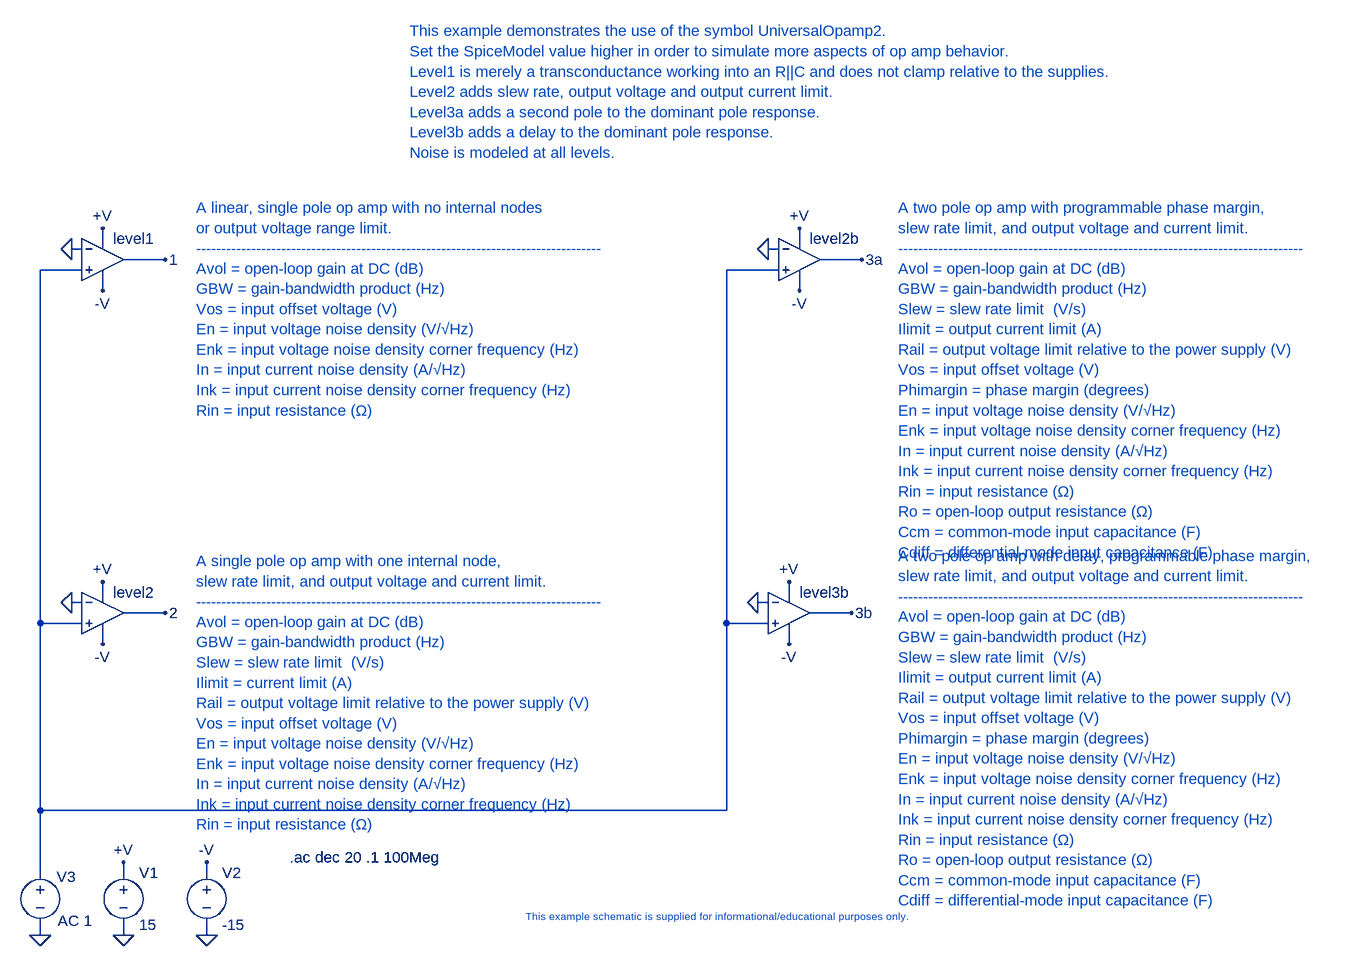
[diagram p0: schematic UniversalOpamp2.asc]
UniversalOpamp2.asc, the LTspice schematic file:
Version 4
SHEET 1 2580 1112
WIRE 144 -224 144 -240
WIRE 1216 -224 1216 -240
WIRE 112 -208 96 -208
WIRE 1184 -208 1168 -208
WIRE 240 -192 176 -192
WIRE 1312 -192 1248 -192
WIRE 112 -176 48 -176
WIRE 1184 -176 1104 -176
WIRE 144 -144 144 -160
WIRE 1216 -144 1216 -160
WIRE 144 320 144 304
WIRE 1200 320 1200 304
WIRE 112 336 96 336
WIRE 1168 336 1152 336
WIRE 240 352 176 352
WIRE 1296 352 1232 352
WIRE 48 368 48 -176
WIRE 112 368 48 368
WIRE 1104 368 1104 -176
WIRE 1168 368 1104 368
WIRE 144 400 144 384
WIRE 1200 400 1200 384
WIRE 48 656 48 368
WIRE 1104 656 1104 368
WIRE 1104 656 48 656
WIRE 48 752 48 656
WIRE 176 752 176 736
WIRE 304 752 304 736
WIRE 48 848 48 832
WIRE 176 848 176 832
WIRE 304 848 304 832
FLAG 144 -240 +V
FLAG 144 -144 -V
FLAG 96 -208 0
FLAG 304 848 0
FLAG 176 848 0
FLAG 176 736 +V
FLAG 304 736 -V
FLAG 48 848 0
FLAG 144 304 +V
FLAG 144 400 -V
FLAG 96 336 0
FLAG 1200 304 +V
FLAG 1200 400 -V
FLAG 1152 336 0
FLAG 1216 -240 +V
FLAG 1216 -144 -V
FLAG 1168 -208 0
FLAG 240 -192 1
FLAG 240 352 2
FLAG 1296 352 3b
FLAG 1312 -192 3a
SYMBOL voltage 176 736 R0
SYMATTR InstName V1
SYMATTR Value 15
SYMBOL voltage 304 736 R0
SYMATTR InstName V2
SYMATTR Value -15
SYMBOL voltage 48 736 R0
WINDOW 0 25 22 Left 2
WINDOW 3 27 90 Left 2
SYMATTR InstName V3
SYMATTR Value AC 1
SYMBOL OpAmps\\UniversalOpamp2 144 -192 R0
SYMATTR InstName level1
SYMATTR SpiceModel level1
SYMBOL OpAmps\\UniversalOpamp2 144 352 R0
SYMATTR InstName level2
SYMATTR SpiceModel level2
SYMBOL OpAmps\\UniversalOpamp2 1216 -192 R0
SYMATTR InstName level2b
SYMBOL OpAmps\\UniversalOpamp2 1200 352 R0
SYMATTR InstName level3b
SYMATTR SpiceModel level3b
TEXT 432 728 Left 2 !.ac dec 20 .1 100Meg
TEXT 288 -272 Left 2 ;A linear, single pole op amp with no internal nodes\nor output voltage range limit.\n---------------------------------------------------------------------------------\nAvol = open-loop gain at DC (dB)\nGBW = gain-bandwidth product (Hz)\nVos = input offset voltage (V)\nEn = input voltage noise density (V/√Hz)\nEnk = input voltage noise density corner frequency (Hz)\nIn = input current noise density (A/√Hz)\nInk = input current noise density corner frequency (Hz)\nRin = input resistance (Ω)
TEXT 288 272 Left 2 ;A single pole op amp with one internal node,\nslew rate limit, and output voltage and current limit.\n---------------------------------------------------------------------------------\nAvol = open-loop gain at DC (dB)\nGBW = gain-bandwidth product (Hz)\nSlew = slew rate limit  (V/s) \nIlimit = current limit (A)\nRail = output voltage limit relative to the power supply (V)\nVos = input offset voltage (V)\nEn = input voltage noise density (V/√Hz)\nEnk = input voltage noise density corner frequency (Hz)\nIn = input current noise density (A/√Hz)\nInk = input current noise density corner frequency (Hz)\nRin = input resistance (Ω)
TEXT 1368 264 Left 2 ;A two pole op amp with delay, programmable phase margin,\nslew rate limit, and output voltage and current limit.\n---------------------------------------------------------------------------------\nAvol = open-loop gain at DC (dB)\nGBW = gain-bandwidth product (Hz)\nSlew = slew rate limit  (V/s) \nIlimit = output current limit (A)\nRail = output voltage limit relative to the power supply (V)\nVos = input offset voltage (V)\nPhimargin = phase margin (degrees)\nEn = input voltage noise density (V/√Hz)\nEnk = input voltage noise density corner frequency (Hz)\nIn = input current noise density (A/√Hz)\nInk = input current noise density corner frequency (Hz)\nRin = input resistance (Ω)\nRo = open-loop output resistance (Ω)\nCcm = common-mode input capacitance (F)\nCdiff = differential-mode input capacitance (F)
TEXT 1368 -272 Left 2 ;A two pole op amp with programmable phase margin,\nslew rate limit, and output voltage and current limit.\n---------------------------------------------------------------------------------\nAvol = open-loop gain at DC (dB)\nGBW = gain-bandwidth product (Hz)\nSlew = slew rate limit  (V/s) \nIlimit = output current limit (A)\nRail = output voltage limit relative to the power supply (V)\nVos = input offset voltage (V)\nPhimargin = phase margin (degrees)\nEn = input voltage noise density (V/√Hz)\nEnk = input voltage noise density corner frequency (Hz)\nIn = input current noise density (A/√Hz)\nInk = input current noise density corner frequency (Hz)\nRin = input resistance (Ω)\nRo = open-loop output resistance (Ω)\nCcm = common-mode input capacitance (F)\nCdiff = differential-mode input capacitance (F)
TEXT 1080 808 Top 1 ;This example schematic is supplied for informational/educational purposes only.
TEXT 616 -544 Left 2 ;This example demonstrates the use of the symbol UniversalOpamp2.\nSet the SpiceModel value higher in order to simulate more aspects of op amp behavior.  \nLevel1 is merely a transconductance working into an R||C and does not clamp relative to the supplies.\nLevel2 adds slew rate, output voltage and output current limit.  \nLevel3a adds a second pole to the dominant pole response.\nLevel3b adds a delay to the dominant pole response.  \nNoise is modeled at all levels.

The netlist it stands for:
* UniversalOpamp2.asc
V1 +V 0 15
V2 -V 0 -15
V3 N001 0 AC 1
Xlevel1 N001 0 +V -V 1 level1 Avol=1Meg GBW=10Meg Slew=10Meg Ilimit=25m Rail=0 Vos=0 En=0 Enk=0 In=0 Ink=0 Rin=500Meg  ; pins In+ In- V+ V- OUT
Xlevel2 N001 0 +V -V 2 level2 Avol=1Meg GBW=10Meg Slew=10Meg Ilimit=25m Rail=0 Vos=0 En=0 Enk=0 In=0 Ink=0 Rin=500Meg  ; pins In+ In- V+ V- OUT
Xlevel2b N001 0 +V -V 3a level.2 Avol=1Meg GBW=10Meg Slew=10Meg ilimit=25m rail=0 Vos=0 phimargin=45 en=0 enk=0 in=0 ink=0 Rin=500Meg  ; pins IN+ IN- V+ V- OUT
Xlevel3b N001 0 +V -V 3b level3b Avol=1Meg GBW=10Meg Slew=10Meg Ilimit=25m Rail=0 Vos=0 En=0 Enk=0 In=0 Ink=0 Rin=500Meg  ; pins In+ In- V+ V- OUT
.ac dec 20 .1 100Meg
* A linear, single pole op amp with no internal nodes
* or output voltage range limit.
* ---------------------------------------------------------------------------------
* Avol = open-loop gain at DC (dB)
* GBW = gain-bandwidth product (Hz)
* Vos = input offset voltage (V)
* En = input voltage noise density (V/√Hz)
* Enk = input voltage noise density corner frequency (Hz)
* In = input current noise density (A/√Hz)
* Ink = input current noise density corner frequency (Hz)
* Rin = input resistance (Ω)
* A single pole op amp with one internal node,
* slew rate limit, and output voltage and current limit.
* ---------------------------------------------------------------------------------
* Avol = open-loop gain at DC (dB)
* GBW = gain-bandwidth product (Hz)
* Slew = slew rate limit  (V/s)
* Ilimit = current limit (A)
* Rail = output voltage limit relative to the power supply (V)
* Vos = input offset voltage (V)
* En = input voltage noise density (V/√Hz)
* Enk = input voltage noise density corner frequency (Hz)
* In = input current noise density (A/√Hz)
* Ink = input current noise density corner frequency (Hz)
* Rin = input resistance (Ω)
* A two pole op amp with delay, programmable phase margin,
* slew rate limit, and output voltage and current limit.
* ---------------------------------------------------------------------------------
* Avol = open-loop gain at DC (dB)
* GBW = gain-bandwidth product (Hz)
* Slew = slew rate limit  (V/s)
* Ilimit = output current limit (A)
* Rail = output voltage limit relative to the power supply (V)
* Vos = input offset voltage (V)
* Phimargin = phase margin (degrees)
* En = input voltage noise density (V/√Hz)
* Enk = input voltage noise density corner frequency (Hz)
* In = input current noise density (A/√Hz)
* Ink = input current noise density corner frequency (Hz)
* Rin = input resistance (Ω)
* Ro = open-loop output resistance (Ω)
* Ccm = common-mode input capacitance (F)
* Cdiff = differential-mode input capacitance (F)
* A two pole op amp with programmable phase margin,
* slew rate limit, and output voltage and current limit.
* ---------------------------------------------------------------------------------
* Avol = open-loop gain at DC (dB)
* GBW = gain-bandwidth product (Hz)
* Slew = slew rate limit  (V/s)
* Ilimit = output current limit (A)
* Rail = output voltage limit relative to the power supply (V)
* Vos = input offset voltage (V)
* Phimargin = phase margin (degrees)
* En = input voltage noise density (V/√Hz)
* Enk = input voltage noise density corner frequency (Hz)
* In = input current noise density (A/√Hz)
* Ink = input current noise density corner frequency (Hz)
* Rin = input resistance (Ω)
* Ro = open-loop output resistance (Ω)
* Ccm = common-mode input capacitance (F)
* Cdiff = differential-mode input capacitance (F)
* This example schematic is supplied for informational/educational purposes only.
* This example demonstrates the use of the symbol UniversalOpamp2.
* Set the SpiceModel value higher in order to simulate more aspects of op amp behavior.
* Level1 is merely a transconductance working into an R||C and does not clamp relative to the supplies.
* Level2 adds slew rate, output voltage and output current limit.
* Level3a adds a second pole to the dominant pole response.
* Level3b adds a delay to the dominant pole response.
* Noise is modeled at all levels.
.lib UniversalOpAmp2.lib
.lib UniversalOpamps2.sub
.backanno
.end